# EAGLE design Noc_Informatyka_v1_1 (EAGLE 6.5.0)
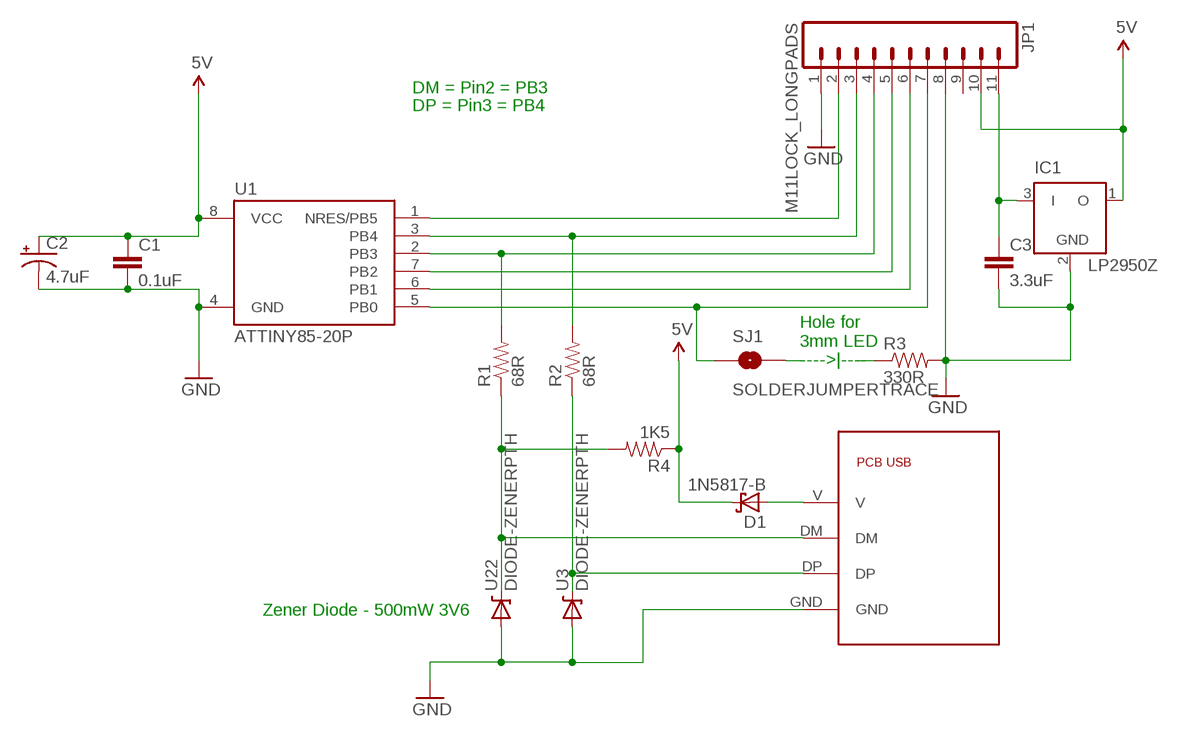
[diagram p0: schematic, sheet 1]

## Parts
C1  0.1uF  CAPEZ  [CAP-PTH-SMALLEZ]
C2  4.7uF  CAP_POLPTH2  [CPOL-RADIAL-10UF-25V]
C3  3.3uF  CAPPTH1  [CAP-PTH-5MM]
D1  1N5817-B  [DO41-7.6]
IC1  LP2950Z  [TO92]
JP1  M11LOCK_LONGPADS  [1X11_LOCK_LONGPADS]
R1  68R  RESISTOREZ  [AXIAL-0.3EZ]
R2  68R  RESISTOREZ  [AXIAL-0.3EZ]
R3  330R  RESISTOREZ  [AXIAL-0.3EZ]
R4  1K5  RESISTOREZ  [AXIAL-0.3EZ]
SJ1  SOLDERJUMPERTRACE  [SJ_2S-TRACE]
U1  ATTINY85-20P  [PDIP08_300MIL]
U3  DIODE-ZENERPTH  [DIODE-ZENER]
U22  DIODE-ZENERPTH  [DIODE-ZENER]
U$1  PCB_USBNOBACK  [PCB_USB]

## Nets
5V: C1.1 C2.1(+) D1.C IC1.1(O) JP1.10 R4.P$1 U1.8(VCC)
GND: C1.2 C2.2(-) C3.2 IC1.2(GND) JP1.1 JP1.8 R3.P$2 U1.4(GND) U3.P$2(A) U22.P$2(A) U$1.GND
N$1: SJ1.2
N$2: R1.P$1 R4.P$2 U22.P$1(C) U$1.DM
N$3: JP1.2 U1.1(NRES/PB5)
N$4: JP1.3 R2.P$2 U1.3(PB4)
N$5: JP1.4 R1.P$2 U1.2(PB3)
N$6: JP1.5 U1.7(PB2)
N$7: JP1.6 U1.6(PB1)
N$8: JP1.7 SJ1.1 U1.5(PB0)
N$9: C3.1 IC1.3(I) JP1.11
N$10: R2.P$1 U3.P$1(C) U$1.DP
N$11: D1.A U$1.V
N$12: R3.P$1
Unconnected: JP1.9

## Notes on the sheet
- DM = Pin2 = PB3
- DP = Pin3 = PB4
- Hole for
  3mm LED
  ---->|----
- Zener Diode - 500mW 3V6

## Library data of the parts
C1 C3 = SparkFun-Capacitors:CAP: Capacitor Standard 0603 ceramic capacitor, and 0.1" leaded capacitor.
C2 = SparkFun-Capacitors:CAP_POL: Capacitor Polarized These are standard SMD and PTH capacitors. Normally 10uF, 47uF, and 100uF in electrolytic and tantalum varieties. Always verify the external diameter of the through hole cap, it varies with capacity, voltage, and manufacturer. The EIA devices should be standard.
D1 = diode:1N581*: 1.0A SCHOTTKY BARRIER RECTIFIER Source: http://www.diodes.com/datasheets/ds23001.pdf
IC1 = linear_longpad:LP2950: 100 mA, Low Power Low Dropout Voltage Regulator Source: http://www.onsemi.com/pub/Collateral/LP2950-D.PDF
JP1 = SparkFun-Connectors:M11: Header 11 Standard 11-pin 0.1" header. Use with straight break away headers (SKU : PRT-00116), right angle break away headers (PRT-00553), swiss pins (PRT-00743), machine pins (PRT-00117), and female headers (PRT-00115).
R1 R2 R4 = SparkFun-Resistors:RESISTOR: Resistor Basic schematic elements and footprints for 0603, 1206, and PTH resistors.
R3 = SparkFun-Passives:RESISTOR: Resistor Basic schematic elements and footprints for 0603, 1206, and PTH resistors.
SJ1 = SparkFun-Passives:SOLDERJUMPER: Solder Jumper Standard SMD solder jumper. Used to automate production. Two varients : Normally Open and Normally Closed are the same, but have different paste layers. NC will have a large amount of paste and should jumper during reflow.
U1 = _hhn_attiny25_45_85:ATTINY85*: ATMEL ATtiny 85 Packages: P = PDIP 08 30mil S = SOIC 08 EIAJ 208mil Technologies Note: for complete ordering code (temp. range, finish, tape&reel etc.) see www.atmel.com • Supply Voltage: V = (1.8…5.5)V | [blank] = (2.7…5.5)V • Speed: 10 = 10 MHz | 20 = 20 MHz Author: Dipl.-Ing. FH Rainer Bayer HHN Hochschule Heilbronn (Heilbronn University), rainer.bayer@hs-heilbronn.de Ingenieurbüro ing-rb, mail@ing-rb.de
U3 U22 = SparkFun-DiscreteSemi:DIODE-ZENER: Zener Diode Production Part - 8199 3.4V Zener Voltage
U$1 = pcb_usb:PCB_USB

## Board
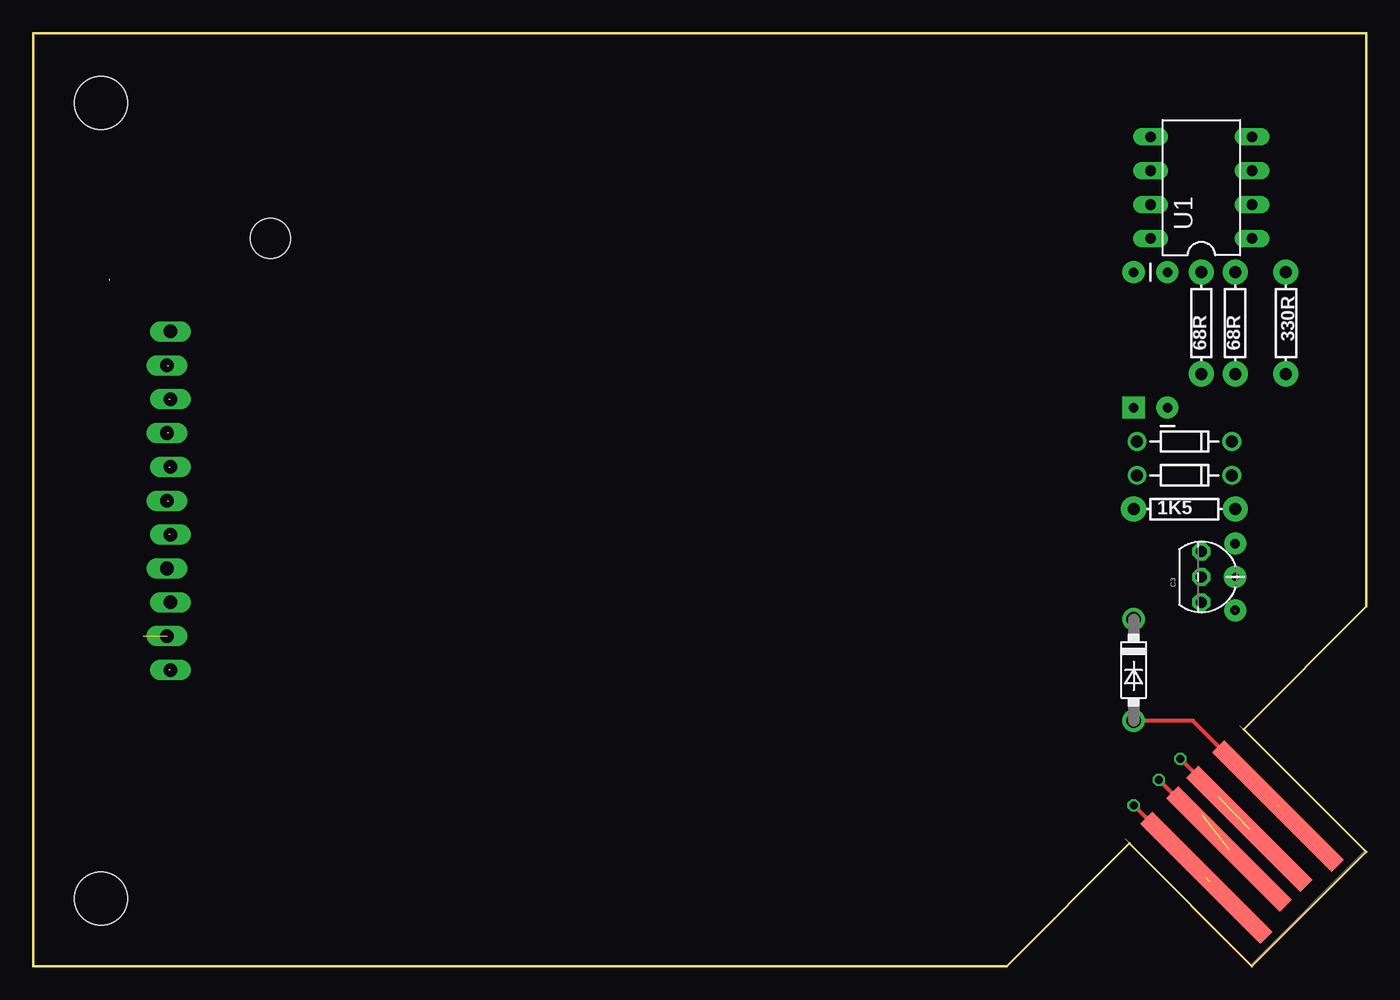
[diagram p1: board, top side]
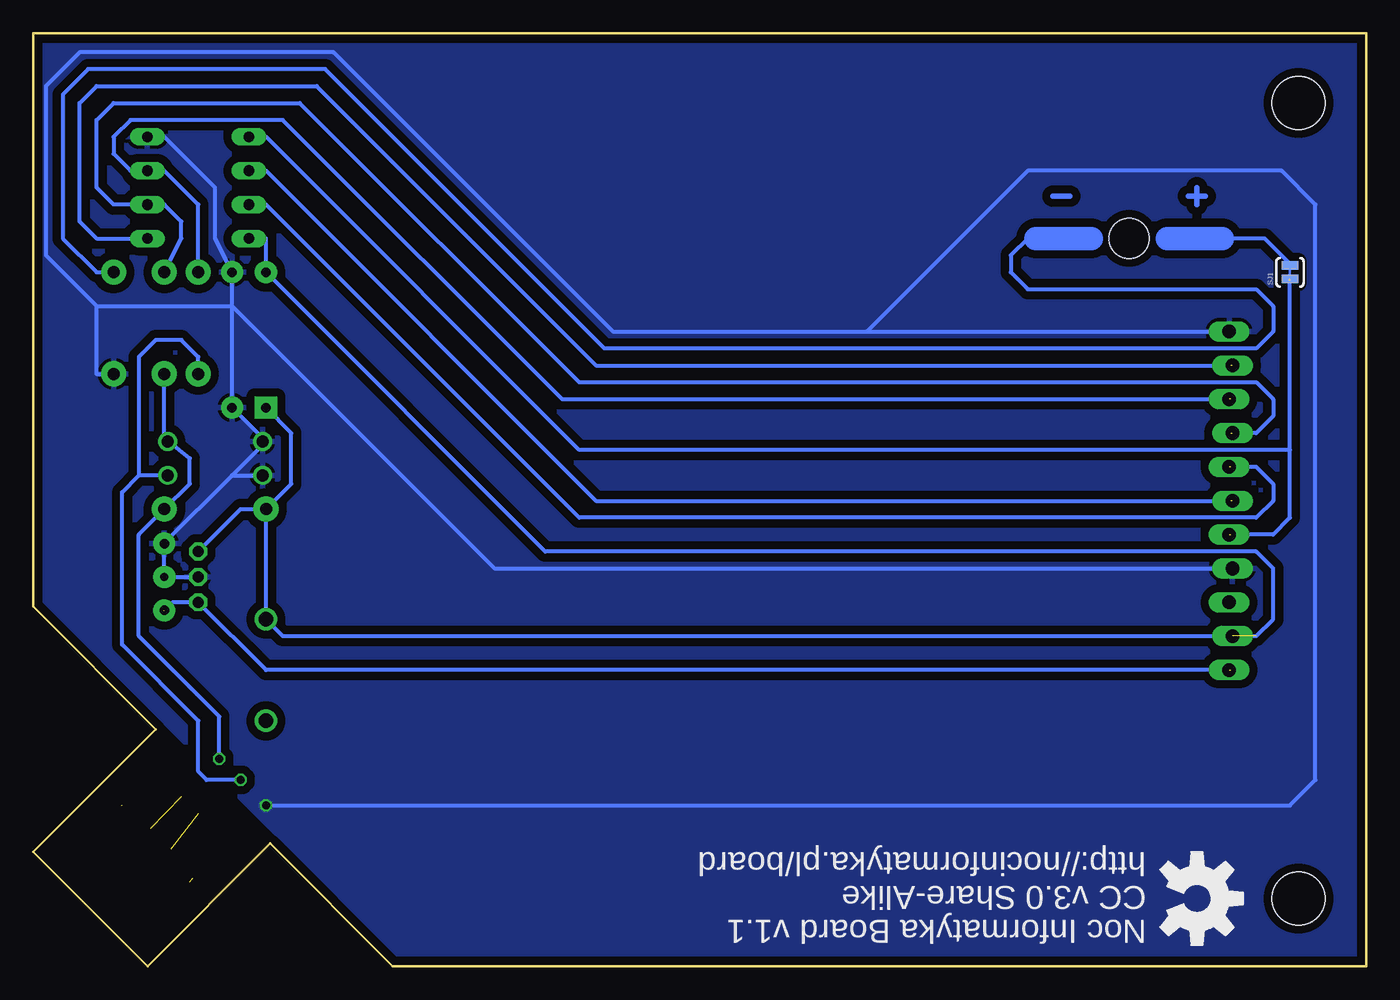
[diagram p2: board, bottom side, seen from below]

Size 100 x 70 mm. Coordinates in mm from the lower left corner, seen from the top.
Outline: 0,0 73.03,0 82.23,9.21 91.43,0 100,8.57 90.81,17.77 100,26.99 100,70 0,70 0,0
Copper layers (1*16): Top 0.035mm / dielectric 1.5mm / Bottom 0.035mm
Design rules "hackvana": minimum track width 6mil, minimum drill 0.3mm, track to track 6mil, track to pad 6mil, pad to pad 6mil, via to via 6mil, smd to smd 0mil, copper to edge 6mil, drill to drill 6mil, minimum pad ring 10mil, minimum via ring 6mil, stop-mask expansion 2mil, vias tented up to drill 100mil, thermal gap 10mil
Holes 4 mm at 5.08,64.77 5.08,5.08
Holes 3 mm at 17.78,54.61

### Footprints (pad centres in the part's own frame; a part is rotated, then mirrored left to right if it is on the bottom)
CAP-PTH-SMALLEZ = drill 0.7 pad 1.651: 1 0,0; 2 2.54,0
CPOL-RADIAL-10UF-25V = drill 0.7 pad 1.651 square: 1 1.27,0 | drill 0.7 pad 1.651: 2 -1.27,0
CAP-PTH-5MM = drill 0.7 pad 1.651: 1 -2.5,0; 2 2.5,0
DO41-7.6 = drill 1.1 pad 1.7: A 3.81,0; C -3.81,0
TO92 = drill 0.813 octagon: 1 -1.905,0; 2 0,0; 3 1.905,0
1X11_LOCK_LONGPADS = drill 1.016 long: 1 0,0.127; 2 2.54,-0.127; 3 5.08,0.127; 4 7.62,-0.127; 5 10.16,0.127; 6 12.7,-0.127; 7 15.24,0.127; 8 17.78,-0.127; 9 20.32,0.127; 10 22.86,-0.127; 11 25.4,0.127
AXIAL-0.3EZ = drill 0.9 pad 1.88: P$1 -3.81,0; P$2 3.81,0
SJ_2S-TRACE = smd 0.635 x 1.27: 1 -0.508,0; 2 0.508,0
PDIP08_300MIL = drill 0.813 long: 1 -3.81,-3.81; 2 -1.27,-3.81; 3 1.27,-3.81; 4 3.81,-3.81; 5 3.81,3.81; 6 1.27,3.81; 7 -1.27,3.81; 8 -3.81,3.81
DIODE-ZENER = drill 0.9: P$1 -3.556,0; P$2 3.556,0
PCB_USB = smd 1.27 x 12.065: DM 2.731,6.032; DP 4.889,6.032 | smd 1.27 x 12.7: GND 7.62,6.35; V 0,6.35

### Placement (x,y rotation side)
C1  82.55,52.07 0 top
C2  83.82,41.91 180 top
C3  90.17,29.21 90 top
D1  82.55,22.23 270 top
IC1  87.63,29.21 270 top
JP1  10.16,47.62 270 top
R1  90.17,48.26 90 top
R2  87.63,48.26 90 top
R3  93.98,48.26 270 top
R4  86.36,34.29 0 top
SJ1  5.71,52.07 90 bottom
U1  87.63,58.42 90 top
U3  86.36,36.83 180 top
U22  86.36,39.37 180 top
U$1  88.9,16.51 225 top
U$2  [OSHW-LOGO-L]  12.7,5.08 270 bottom

### Tracks (layer width: path | path; a pad name or v marks a point on that pad's centre or on a via)
5V  (1 unrouted)
  Bottom 0.305: R4.P$1 80.64,36.2 80.64,40.01 C2.1 | R4.P$1 D1.C 81.28,24.77 8.26,24.77 6.99,26.04 6.99,29.84 8.26,31.11 61.59,31.11 C1.1 82.55,54.61 U1.8 | R4.P$1 84.45,34.29 IC1.1
GND  (via drill 0.6)  (1 unrouted)
  Top 0.305: 88.27,6.35 v82.55,12.06
  Bottom 0.305: 95.25,49.53 99.06,53.34 99.06,66.04 96.52,68.58 77.47,68.58 56.52,47.62 37.47,47.62 | 95.25,49.53 85.09,49.53 | 85.09,49.53 C1.2 86.36,54.61 86.36,58.42 90.17,62.23 U1.4 | 85.09,49.53 65.41,29.84 10.16,29.84 | 85.09,49.53 C2.2 82.55,39.37 | 82.55,39.37 85.09,36.83 | 95.25,49.53 95.25,44.45 R3.P$2 | 85.09,36.83 U3.P$2 | 82.55,39.37 U22.P$2 | 37.47,47.62 10.16,47.62 | 85.09,36.83 90.17,31.75 90.17,29.84 89.53,29.21 IC1.2 | v82.55,12.06 5.71,12.06 3.81,13.97 3.81,57.15 6.35,59.69 25.4,59.69 37.47,47.62
  pour Bottom (isolate 0.61): 0,70 0,0 73.03,0 81.92,8.89 81.28,9.53 90.17,18.41 90.81,17.78 100,27 100,70
N$2  (via drill 0.6)  (1 unrouted)
  Top 0.305: 88.9,12.7 v86.04,15.56
  Bottom 0.305: R1.P$1 90.17,39.37 U22.P$1 89.85,39.37 88.27,38.1 88.27,36.2 R4.P$2 92.08,32.38 92.08,24.77 86.04,18.73 v86.04,15.56
N$3  (1 unrouted)
  Bottom 0.305: U1.1 95.25,54.61 96.52,55.88 96.52,64.77 95.25,66.04 78.74,66.04 57.78,45.09 10.16,45.09
N$4  (1 unrouted)
  Bottom 0.305: R2.P$2 87.63,57.15 90.17,59.69 U1.3 92.71,59.69 93.98,60.96 93.98,62.23 92.71,63.5 81.28,63.5 60.33,42.55 10.16,42.55
N$5  (1 unrouted)
  Bottom 0.305: R1.P$2 88.9,54.61 88.9,55.88 90.17,57.15 U1.2 93.98,57.15 95.25,58.42 95.25,63.5 93.98,64.77 80.01,64.77 59.05,43.81 8.26,43.81 6.99,42.55 6.99,41.27 8.26,40.01 10.16,40.01
N$6  (1 unrouted)
  Bottom 0.305: U1.7 82.55,57.15 59.05,33.66 8.26,33.66 6.99,34.92 6.99,36.2 8.26,37.47 10.16,37.47
N$7  (1 unrouted)
  Bottom 0.305: U1.6 82.55,59.69 57.78,34.92 10.16,34.92
N$8  (2 unrouted)
  Bottom 0.305: 5.71,38.73 5.71,33.66 6.99,32.38 10.16,32.38 | 5.71,38.73 59.05,38.73 82.55,62.23 U1.5 | 5.71,38.73 5.71,51.44
N$9  (2 unrouted)
  Bottom 0.305: 10.16,22.23 82.55,22.23 IC1.3 89.53,27.3 90.17,26.67
N$10  (via drill 0.6)  (1 unrouted)
  Top 0.305: 87.63,11.43 87,11.43 v84.45,13.97
  Bottom 0.305: R2.P$1 87.63,45.72 88.9,46.99 90.81,46.99 92.08,45.72 92.08,36.83 | U3.P$1 92.08,36.83 | v84.45,13.97 87,13.97 87.63,14.61 87.63,18.41 93.34,24.13 93.34,35.56 92.08,36.83
N$11  (1 unrouted)
  Top 0.305: 93.34,12.06 87,18.41 D1.A
N$12
  Bottom 0.305: R3.P$1 95.25,52.07 97.79,54.61 97.79,65.41 95.89,67.31 78.11,67.31 57.15,46.35 8.26,46.35 6.99,47.62 6.99,49.53 8.26,50.8 25.4,50.8 26.67,52.07 26.67,53.34 25.4,54.61 24.77,54.61
  Bottom 1.778: 20.64,54.61 24.77,54.61
N$13  (via drill 0.6 pad 1.68)
  other vias: 90.17,29.21
N$14
  Bottom 0.406: 12.06,57.78 13.34,57.78
N$15
  Bottom 0.406: 22.23,57.78 23.5,57.78
N$16
  Bottom 0.406: 12.7,58.42 12.7,57.15
N$17
  Bottom 0.305: 5.71,52.7 7.62,54.61 10.79,54.61
  Bottom 1.778: 10.79,54.61 14.92,54.61

### Text on the board
bPlace: http://nocinformatyka.pl/board | CC v3.0 Share-Alike | Noc Informatyka Board v1.1
mfgcode.gbo: XxXxXxXxXxXx